# Altium schematic sheet ra1.SchDoc
size 660 x 381 mm; SheetNumber: 1; SheetTotal: 1
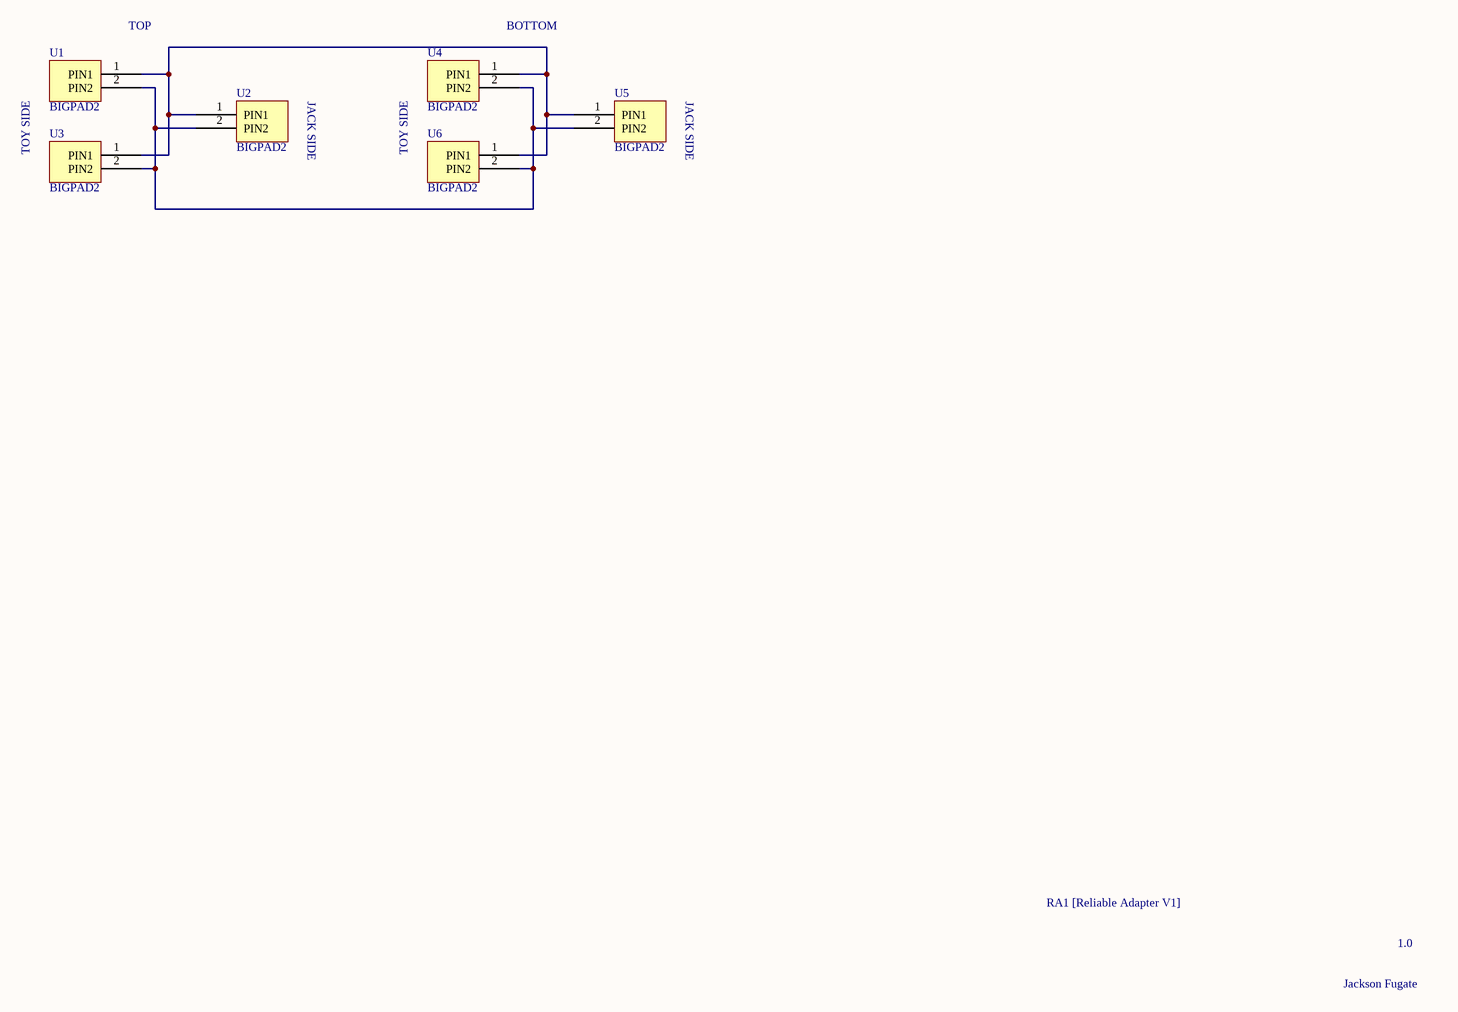
[diagram p0: ra1.SchDoc]

## Parts
U1  BIGPAD2  [BIGPAD2]
U2  BIGPAD2  [BIGPAD2]
U3  BIGPAD2  [BIGPAD2]
U4  BIGPAD2  [BIGPAD2]
U5  BIGPAD2  [BIGPAD2]
U6  BIGPAD2  [BIGPAD2]

## Nets
NetU1_1: U1.1(PIN1) U2.1(PIN1) U3.1(PIN1) U4.1(PIN1) U5.1(PIN1) U6.1(PIN1)
NetU1_2: U1.2(PIN2) U2.2(PIN2) U3.2(PIN2) U4.2(PIN2) U5.2(PIN2) U6.2(PIN2)

## Notes on the sheet
- (near U1) TOP
- (near U4) BOTTOM
- JACK SIDE
- TOY SIDE
- RA1 [Reliable Adapter V1]
- 1.0
- Jackson Fugate